# EAGLE design ASD2005 (EAGLE 6.3)
DATABASE: ./../../../../../Components/TinyCircuits_Part_Database.txt
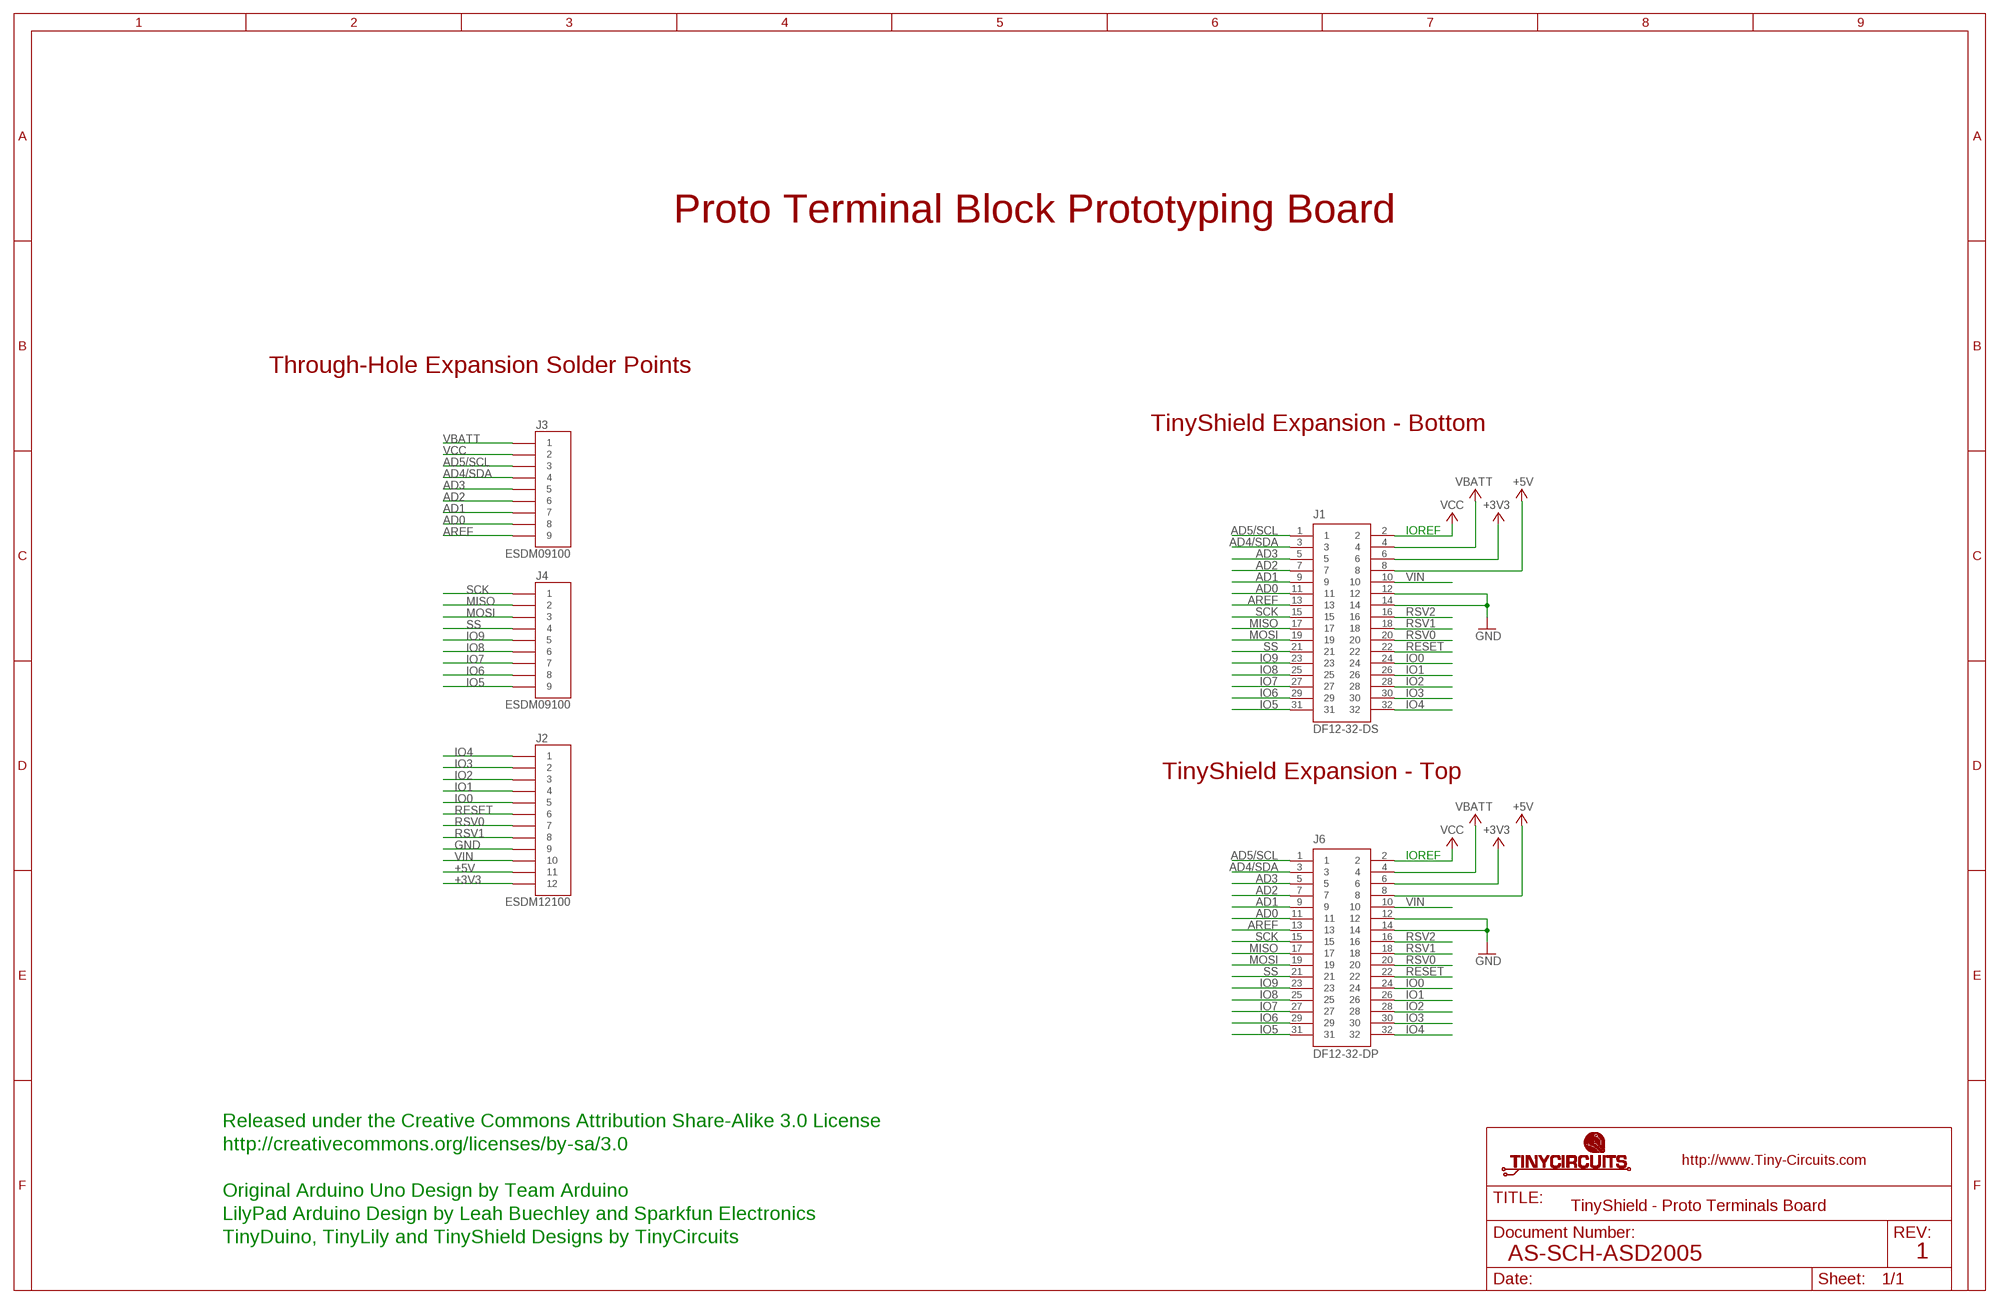
[diagram p0: schematic, sheet 1]

## Parts
J1  DF12-32-DS  AS-ITM-00012  [DF12-32-DS]
J2  ESDM12100  AS-ITM-00123  [12POS_2.54MM_TERMBLOCK]
J3  ESDM09100  AS-ITM-00124  [9POS_2.54MM_TERMBLOCK]
J4  ESDM09100  AS-ITM-00124  [9POS_2.54MM_TERMBLOCK]
J6  DF12-32-DP  AS-ITM-00015  [DF12-32-DP]

## Nets
+3V3: J1.6 J2.P$13 J6.6
+5V: J1.8 J2.P$12 J6.8
AD0: J1.11 J3.P$8 J6.11
AD1: J1.9 J3.P$7 J6.9
AD2: J1.7 J3.P$6 J6.7
AD3: J1.5 J3.P$5 J6.5
AD4/SDA: J1.3 J3.P$4 J6.3
AD5/SCL: J1.1 J3.P$3 J6.1
AREF: J1.13 J3.P$9 J6.13
GND: J1.12 J1.14 J2.P$9 J6.12 J6.14
IO0: J1.24 J2.P$5 J6.24
IO1: J1.26 J2.P$4 J6.26
IO2: J1.28 J2.P$3 J6.28
IO3: J1.30 J2.P$2 J6.30
IO4: J1.32 J2.P$1 J6.32
IO5: J1.31 J4.P$9 J6.31
IO6: J1.29 J4.P$8 J6.29
IO7: J1.27 J4.P$7 J6.27
IO8: J1.25 J4.P$6 J6.25
IO9: J1.23 J4.P$5 J6.23
MISO: J1.17 J4.P$2 J6.17
MOSI: J1.19 J4.P$3 J6.19
RESET: J1.22 J2.P$6 J6.22
RSV0: J1.20 J2.P$7 J6.20
RSV1: J1.18 J2.P$8 J6.18
RSV2: J1.16 J6.16
SCK: J1.15 J4.P$1 J6.15
SS: J1.21 J4.P$4 J6.21
VBATT: J1.4 J3.P$1 J6.4
VCC: J1.2 J3.P$2 J6.2
VIN: J1.10 J2.P$10 J6.10

## Notes on the sheet
- Proto Terminal Block Prototyping Board
- Through-Hole Expansion Solder Points
- TinyShield Expansion - Bottom
- IOREF
- TinyShield Expansion - Top
- IOREF
- Released under the Creative Commons Attribution Share-Alike 3.0 License
- http://creativecommons.org/licenses/by-sa/3.0
- Original Arduino Uno Design by Team Arduino
- TinyShield - Proto Terminals Board
- LilyPad Arduino Design by Leah Buechley and Sparkfun Electronics
- TinyDuino, TinyLily and TinyShield Designs by TinyCircuits
- AS-SCH-ASD2005 | 1

## Library data of the parts
J1 = tinycircuits:AS-ITM-00012: CONN RECEPT 32POS 3MM SMD 0.5MM; PARTNO: AS-ITM-00012
J2 = tinycircuits:AS-ITM-00123: CONN TERM BLK 12POS 2.54MM 4/A; PARTNO: AS-ITM-00123
J3 J4 = tinycircuits:AS-ITM-00124: CONN TERM BLK 9POS 2.54MM R/A BK; PARTNO: AS-ITM-00124
J6 = tinycircuits:AS-ITM-00015: CONN HEADER 32POS 3MM SMD 0.5MM; PARTNO: AS-ITM-00015

## Board
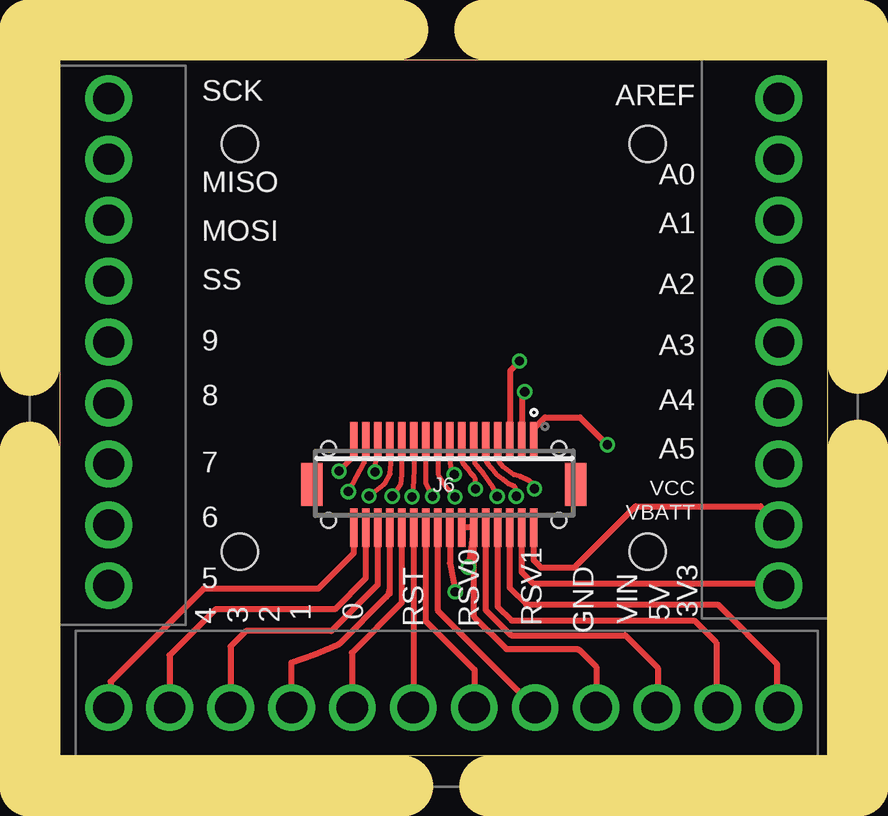
[diagram p1: board, top side]
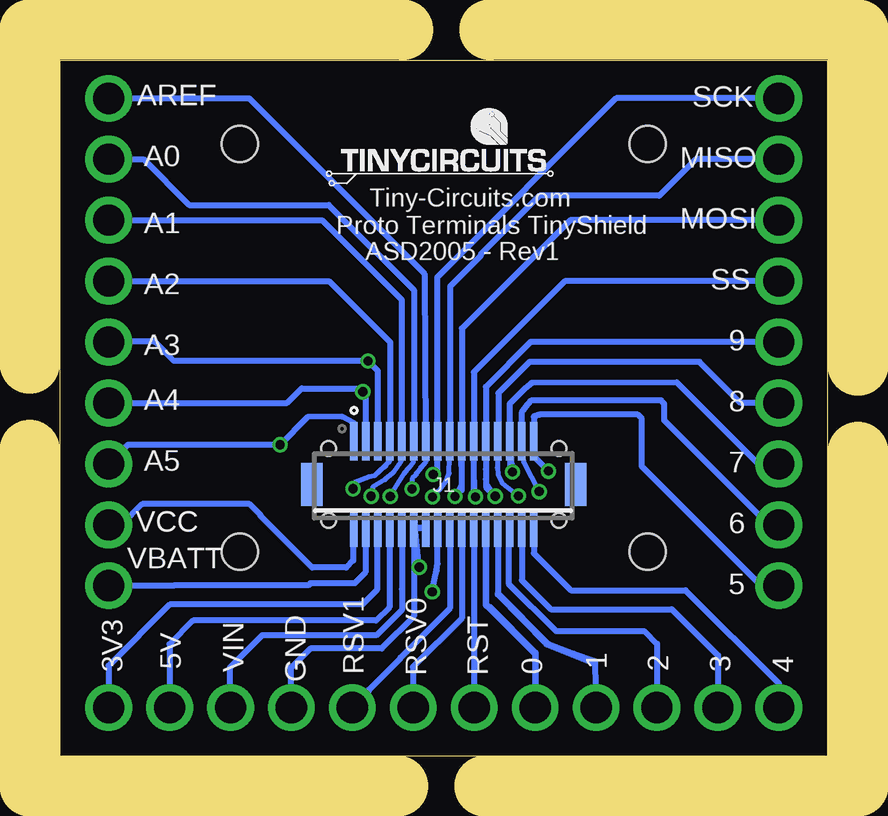
[diagram p2: board, bottom side, seen from below]

Size 32 x 29 mm. Coordinates in mm from the lower left corner, seen from the top.
Outline: 0,0 0,29 32,29 32,0 0,0
Copper layers (1*16): Top 0.035mm / dielectric 1.5mm / Bottom 0.035mm
Design rules "default": minimum track width 8mil, minimum drill 15mil, track to track 6mil, track to pad 6mil, pad to pad 6mil, via to via 6mil, smd to smd 6mil, copper to edge 6mil, drill to drill 8mil, minimum pad ring 10mil, minimum via ring 5mil, stop-mask expansion 4mil, vias tented up to drill 25mil, thermal gap 10mil
Holes 1.5 mm at 7.5,25.5 24.5,25.5 24.5,8.5 7.5,8.5
Milling: 8 lines

### Footprints (pad centres in the part's own frame; a part is rotated, then mirrored left to right if it is on the bottom)
DF12-32-DS = smd 0.3 x 1.6: 1 -3.75,1.8; 2 -3.75,-1.8; 3 -3.25,1.8; 4 -3.25,-1.8; 5 -2.75,1.8; 6 -2.75,-1.8; 7 -2.25,1.8; 8 -2.25,-1.8; 9 -1.75,1.8; 10 -1.75,-1.8; 11 -1.25,1.8; 12 -1.25,-1.8; 13 -0.75,1.8; 14 -0.75,-1.8; 15 -0.25,1.8; 16 -0.25,-1.8; 17 0.25,1.8; 18 0.25,-1.8; 19 0.75,1.8; 20 0.75,-1.8; 21 1.25,1.8; 22 1.25,-1.8; 23 1.75,1.8; 24 1.75,-1.8; 25 2.25,1.8; 26 2.25,-1.8; 27 2.75,1.8; 28 2.75,-1.8; 29 3.25,1.8; 30 3.25,-1.8; 31 3.75,1.8; 32 3.75,-1.8 | smd 0.9 x 1.8: F1 -5.5,0; F2 5.5,0 | hole 0.6: -4.8,1.5; 4.8,1.5
12POS_2.54MM_TERMBLOCK = drill 1.3: P$1 -13.97,0; P$2 -11.43,0; P$3 -8.89,0; P$4 -6.35,0; P$5 -3.81,0; P$6 -1.27,0; P$7 1.27,0; P$8 3.81,0; P$9 6.35,0; P$10 8.89,0; P$12 11.43,0; P$13 13.97,0
9POS_2.54MM_TERMBLOCK = drill 1.3: P$1 -10.16,0; P$2 -7.62,0; P$3 -5.08,0; P$4 -2.54,0; P$5 0,0; P$6 2.54,0; P$7 5.08,0; P$8 7.62,0; P$9 10.16,0
DF12-32-DP = smd 0.3 x 1.6: 1 -3.75,-1.8; 2 -3.75,1.8; 3 -3.25,-1.8; 4 -3.25,1.8; 5 -2.75,-1.8; 6 -2.75,1.8; 7 -2.25,-1.8; 8 -2.25,1.8; 9 -1.75,-1.8; 10 -1.75,1.8; 11 -1.25,-1.8; 12 -1.25,1.8; 13 -0.75,-1.8; 14 -0.75,1.8; 15 -0.25,-1.8; 16 -0.25,1.8; 17 0.25,-1.8; 18 0.25,1.8; 19 0.75,-1.8; 20 0.75,1.8; 21 1.25,-1.8; 22 1.25,1.8; 23 1.75,-1.8; 24 1.75,1.8; 25 2.25,-1.8; 26 2.25,1.8; 27 2.75,-1.8; 28 2.75,1.8; 29 3.25,-1.8; 30 3.25,1.8; 31 3.75,-1.8; 32 3.75,1.8 | smd 0.9 x 1.8: F1 -5.5,0; F2 5.5,0 | hole 0.6: -4.8,1.5; 4.8,1.5

### Placement (x,y rotation side)
J1  16,11.3 0 bottom
J2  16,2 0 top
J3  29.97,17.24 90 top
J4  2.03,17.24 270 top
J6  16,11.3 180 top
U$1  [DOCFIELD-TINYCIRCUITS-PCB]  39.91,-3 0 top  (outside the outline)

### Tracks (layer width: path | path; a pad name or v marks a point on that pad's centre or on a via)
+3V3
  Top 0.254: J6.6 18.75,6.99 19.45,6.3 27.42,6.3 29.89,3.82 29.89,2.08 J2.P$13
  Bottom 0.203: 18.73,9.48 J6.6
  Bottom 0.254: J6.6 18.78,9.47 18.78,6.91 19.39,6.3 27.42,6.3 29.97,3.74 J2.P$13
+5V
  Top 0.254: J6.8 18.25,6.2 18.83,5.63 26.45,5.63 27.36,4.71 27.36,2.07 J2.P$12
  Bottom 0.254: J6.8 18.27,9.48 18.27,6.19 18.83,5.63 26.45,5.63 27.43,4.64 J2.P$12
AD0  (via drill 0.38)
  Top 0.203: J6.11 17.28,12.19 17.37,12.09 17.66,11.73 18.01,11.24 v18.23,10.81
  Bottom 0.203: v18.23,10.81 18.1,11.06 17.87,11.42 17.63,11.77 17.43,12.01 17.27,12.23 J6.11
  Bottom 0.254: J3.P$8 28.52,24.86 26.61,22.96 20.79,22.96 17.25,19.41 J6.11 | J6.11
AD1  (via drill 0.38)
  Top 0.203: v19.02,10.81 19.04,10.85 19.06,10.95 18.97,11.21 18.71,11.33 18.48,11.51 18.21,11.7 18,11.98 17.85,12.16 17.71,12.45 J6.9
  Bottom 0.203: J6.9 17.77,12.6 17.79,12.26 18.12,11.79 18.45,11.51 18.96,11.2 18.96,10.79 v19.02,10.81
  Bottom 0.254: J3.P$7 21.08,22.32 17.76,19 17.76,13.11 J6.9 17.75,12.62 17.77,12.6
AD2  (via drill 0.38)
  Top 0.203: v19.79,11.13 19.74,11.35 19.58,11.46 19.18,11.63 18.91,11.72 18.49,12.03 18.31,12.25 J6.7
  Bottom 0.203: J6.7 18.29,12.3 18.43,12.07 18.89,11.67 | 18.89,11.67 19.12,11.62 19.71,11.39 v19.79,11.13 | 18.29,12.24 18.89,11.67
  Bottom 0.254: J3.P$6 20.79,19.78 18.24,17.23 18.24,12.63 18.28,12.58 18.28,12.38 18.3,12.37 18.29,12.24
AD3  (via drill 0.38)
  Top 0.254: v19.16,16.45 19.16,16.44 18.76,16.04 18.76,13.11 J6.5
  Bottom 0.254: J6.5 18.75,16.04 v19.16,16.45 27.25,16.45 28.06,17.26 29.95,17.26 J3.P$5
AD4/SDA  (via drill 0.38)
  Top 0.254: v19.37,15.17 v19.37,15.16 19.25,15.04 J6.3
  Bottom 0.254: J6.3 19.25,15.05 v19.37,15.17 19.52,15.31 21.92,15.31 22.53,14.7 J3.P$4
AD5/SCL  (via drill 0.38)
  Top 0.254: J6.1 19.75,13.62 20.23,14.1 21.68,14.1 v22.82,12.96
  Bottom 0.254: J3.P$3 29.17,12.96 v22.82,12.96 21.69,14.11 20.23,14.13 19.75,13.86 J6.1
AREF  (via drill 0.38)
  Top 0.203: v17.33,11.12 17.33,11.33 17.32,11.34 17.31,11.5 17.25,11.63 17.25,11.65 17.17,11.73 17.17,11.74 17.17,11.72 17.04,11.92 16.91,12.06 16.9,12.06 16.91,12.07 16.82,12.16 16.79,12.21 16.79,13.07 J6.13
  Bottom 0.203: 16.77,14.58 J6.13 | J6.13 16.75,14.01 16.78,14.04 16.78,13.13 J6.13 | J6.13 16.75,12.27 16.95,12.02 17,11.95 17.14,11.78 17.17,11.7 17.32,11.55 17.32,11.28 17.29,11.26 17.29,11.15 v17.33,11.12 | J6.13 | J6.13
  Bottom 0.254: J3.P$9 24.11,27.4 16.81,20.09 16.77,13.16 J6.13
GND  (via drill 0.38)
  Top 0.254: J6.12 17.25,5.81 18.61,4.45 21.59,4.45 21.63,4.4 21.65,4.4 22.36,3.7 22.36,1.93 22.3,1.93 22.27,1.96 | J6.12 J6.14 | J6.12 17.23,9.3 v17.02,7.85
  Bottom 0.254: J6.12 J6.14 J6.12 | J6.12 17.25,5.8 18.59,4.46 21.56,4.46 22.39,3.64 22.39,2.04 J2.P$9 | J6.12 | v17.02,7.85 17.19,9.56 J6.12
IO0
  Top 0.254: J6.24 14.25,6.37 12.17,4.29 12.17,2.02 J2.P$5
  Bottom 0.254: J2.P$5 12.19,4.24 14.25,6.3 J6.24 14.25,6.27 14.2,6.21 14.09,6.21 12.17,4.29 12.17,1.94 12.07,1.84 12.07,2.09 12.11,2.13
IO1
  Top 0.254: J2.P$4 9.65,3.88 10.61,4.22 11.65,4.66 13.6,6.61 | 13.6,6.61 13.7,6.73 13.75,6.95 J6.26 13.75,6.76 13.6,6.61
  Bottom 0.254: 9.72,3.94 10.57,4.24 11.65,4.66 13.75,6.76 J6.26 13.75,6.71 11.73,4.65 9.69,3.85 J2.P$4
IO2
  Top 0.254: J6.28 13.25,7.12 11.32,5.19 7.75,5.19 7.11,4.55 J2.P$3
  Bottom 0.254: J6.28 13.29,9.46 13.29,7.16 11.32,5.19 7.64,5.19 7.11,4.66 J2.P$3
IO3
  Top 0.254: J6.30 12.75,7.39 11.46,6.1 6.49,6.1 4.57,4.18 J2.P$2
  Bottom 0.254: J6.30 12.75,7.31 11.54,6.1 6.49,6.1 4.57,4.18 J2.P$2
IO4
  Top 0.254: J6.32 12.25,8.44 10.77,6.95 5.98,6.95 2.11,3.08 2.11,2.08 J2.P$1
  Bottom 0.254: J6.32 12.24,8.43 10.7,6.89 5.92,6.89 2.03,3 J2.P$1
IO5  (via drill 0.38)
  Top 0.203: J6.31 12.25,12.48 v11.63,11.86
  Bottom 0.203: v11.63,11.86 12.21,12.44 12.21,13.06 J6.31
  Bottom 0.254: J4.P$9 2.76,7.08 7.75,12.06 7.75,14.05 7.91,14.21 12,14.21 12.24,14.13 12.18,14.13 12.24,14.14 12.24,13.11 J6.31 12.25,12.48 v11.63,11.86
IO6  (via drill 0.38)
  Top 0.203: J6.29 12.68,12.21 v12.02,11
  Bottom 0.203: v12.02,11 12.66,12.22 J6.29
  Bottom 0.254: J4.P$8 2.45,9.62 6.8,13.98 6.8,14.66 6.95,14.8 12.36,14.79 12.5,14.65 12.52,14.61 12.75,14.29 12.75,13.21 J6.29
IO7  (via drill 0.38)
  Top 0.203: v13.14,11.82 J6.27
  Bottom 0.203: J6.27 v13.14,11.82
  Bottom 0.254: J4.P$7 2.88,12.16 6.28,15.56 12.33,15.54 12.62,15.3 13.25,14.66 J6.27 13.25,11.93 v13.14,11.82
IO8  (via drill 0.38)
  Top 0.203: v12.89,10.82 13.52,11.33 13.76,11.74 13.8,12.18 J6.25
  Bottom 0.203: 13.78,13.13 J6.25 | J6.25 13.77,12.01 13.73,11.72 13.56,11.35 v12.89,10.82 | J6.25 | J6.25
  Bottom 0.254: J4.P$6 3.63,14.7 5.34,16.41 12.43,16.41 13.73,15.11 13.73,13.12 J6.25
IO9  (via drill 0.38)
  Top 0.203: v13.86,10.81 14.21,11.33 14.25,11.72 J6.23
  Bottom 0.203: J6.23 14.26,11.93 14.22,11.34 v13.86,10.81
  Bottom 0.254: J4.P$5 12.38,17.24 14.25,15.37 J6.23 14.25,11.53 14.23,11.51 14.23,11.19 v13.86,10.81
MISO  (via drill 0.38)
  Top 0.203: J6.17 15.77,11.73 16.05,11.24 16.44,10.78 v16.47,10.79
  Bottom 0.203: v16.47,10.79 16.55,10.84 16.18,11.07 15.9,11.43 15.78,11.77 J6.17
  Bottom 0.254: J4.P$2 5.49,24.86 7.01,23.34 12,23.34 14.46,20.88 14.46,20.83 15.74,19.55 15.74,13.11 J6.17
MOSI  (via drill 0.38)
  Top 0.203: v15.53,10.8 15.26,11.33 15.25,11.83 J6.19
  Bottom 0.203: J6.19 15.26,11.72 15.23,11.34 v15.53,10.8
  Bottom 0.254: J4.P$3 10.73,22.32 15.24,17.8 15.24,12.59 15.25,12.58 15.25,12.06 15.25,12.61 15.25,12.44 15.25,11.4 15.26,11.4 15.26,11.07 v15.53,10.8
RESET
  Top 0.254: J6.22 14.75,2.02 J2.P$6
  Bottom 0.254: J6.22 14.75,2.02 J2.P$6
RSV0
  Top 0.254: J6.20 15.25,5.61 17.28,3.58 17.28,2.01 J2.P$7
  Bottom 0.254: J6.20 15.25,5.72 17.28,3.69 17.28,2.01 J2.P$7
RSV1
  Top 0.254: J6.18 15.75,6.06 J2.P$8
  Bottom 0.254: J6.18 15.75,6.14 17.81,4.08 17.81,4.06 19.12,2.75 19.12,2.69 J2.P$8
RSV2  (via drill 0.38)
  Top 0.254: J6.16 | J6.16 | J6.16 16.25,8.01 v16.48,6.83
  Bottom 0.254: v16.48,6.83 16.3,7.71 16.25,8.01 J6.16 | J6.16 | J6.16
SCK  (via drill 0.38)
  Top 0.203: v16.44,11.72 16.29,12.04 16.26,12.4 J6.15
  Bottom 0.203: J6.15 16.25,12.14 v16.44,11.72
  Bottom 0.254: J4.P$1 8.81,27.4 16.28,19.93 16.28,11.88 v16.44,11.72
SS  (via drill 0.38)
  Top 0.203: v14.68,10.79 14.71,10.99 14.75,11.46 14.78,11.99 J6.21
  Bottom 0.203: J6.21 14.76,11.99 14.73,11.34 14.72,10.98 v14.68,10.79
  Bottom 0.254: J4.P$4 10.95,19.78 14.74,15.99 14.74,12.6 14.76,12.58 14.76,10.87 v14.68,10.79
VBATT
  Top 0.254: J6.4 19.25,7.65 19.72,7.18 29.87,7.18 J3.P$1
  Bottom 0.254: J6.4 19.26,7.64 19.72,7.18 21.56,7.18 21.64,7.1 27.23,7.1 27.25,7.08 J3.P$1
VCC
  Top 0.254: J6.2 19.75,8.15 20.06,7.84 21.49,7.84 21.49,7.88 24,10.39 29.2,10.39 J3.P$2
  Bottom 0.254: J6.2 19.77,9.48 19.77,8.13 20.06,7.84 21.49,7.84 23.66,10.01 23.66,10.04 24.1,10.49 28.57,10.49 29.44,9.62 J3.P$2
VIN
  Top 0.254: J6.10 17.75,6.07 18.81,5.01 23.57,5.01 24.93,3.66 24.93,2.04 J2.P$10
  Bottom 0.254: J2.P$10 24.93,2.04 24.93,3.66 23.57,5.01 18.81,5.01 17.75,6.07 J6.10 17.75,6.94 | 17.75,6.94

### Text on the board
tPlace: SCK | AREF | A0 | MISO | A1 | MOSI | SS | A2 | A3 | 9 | 8 | A4 | A5 | 7 | VCC | 6 | VBATT | RSV0 | RSV1 | RST | GND | VIN | 3V3 | 5 | 5V | 4 | 3 | 2 | 1 | 0
bPlace: AREF | SCK | MISO | A0 | Tiny-Circuits.com | A1 | MOSI | Proto Terminals TinyShield | ASD2005 - Rev1 | SS | A2 | A3 | 9 | 8 | A4 | A5 | 7 | 6 | VCC | VBATT | 5 | RSV0 | RSV1 | RST | GND | VIN | 3V3 | 5V | 4 | 3 | 2 | 1 | 0
Document: FABRICATION DRAWING | NOTES: | 1. PRINTED CIRCUIT BOARD MADE FROM NEMA GRADE FR-4 EPOXY LAMINATE | WITH 1 OUNCE COPPER PLATING AND .024 THICKNESS. | 2. ALL DIMENSIONS ARE GIVEN IN INCHES. | 3. CIRCUIT PATHS ARE FOR REFERENCE ONLY. | 4. HOLE SIZES SHOWN ARE FINISHED DIAMETERS AFTER PLATING. | 5. BOARD PLATED USING REFLOW OR SIMILAR METHOD. | 6. BOARD TO HAVE BLUE SOLDER MASK ON PLATED SURFACES USING WET FILM | 7. SILKSCREEN BOARD USING WHITE INK. | SR100 OR SR1010 EPOXY. EQUIVALENT WET OR DRY FILM MAY BE USED. | 8. THE FOLLOWING INFORMATION APPLIES TO THIS BOARD: | * 2 COPPER LAYERS | * .024 BOARD THICKNESS | * REQUIRES TOP and BOTTOM SIDE SILKSCREEN | Released under the Creative Commons Attribution Share-Alike 3.0 License | http://creativecommons.org/licenses/by-sa/3.0 | Original Arduino Uno Design by Team Arduino | LilyPad Arduino Design by Leah Buechley and Sparkfun Electronics | TinyDuino, TinyLily and TinyShield Designs by TinyCircuits | TinyShield - Proto Terminals Board | AS-PCB-ASD2005 | 1 | 1/1